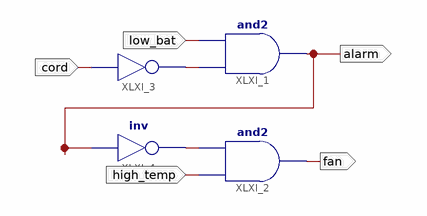
[diagram p0: schematic sheet 1]
// Xilinx ISE schematic alarm_fan.sch (spartan3e) as structural Verilog: 4 symbols, 5 ports
module alarm_fan (
  input  cord,
  input  low_bat,
  input  high_temp,
  output alarm,
  output fan
);

  wire XLXN_1, XLXN_2;

  and XLXI_1 (alarm, XLXN_1, low_bat);
  and XLXI_2 (fan, high_temp, XLXN_2);
  not XLXI_3 (XLXN_1, cord);
  not XLXI_4 (XLXN_2, alarm);
endmodule
